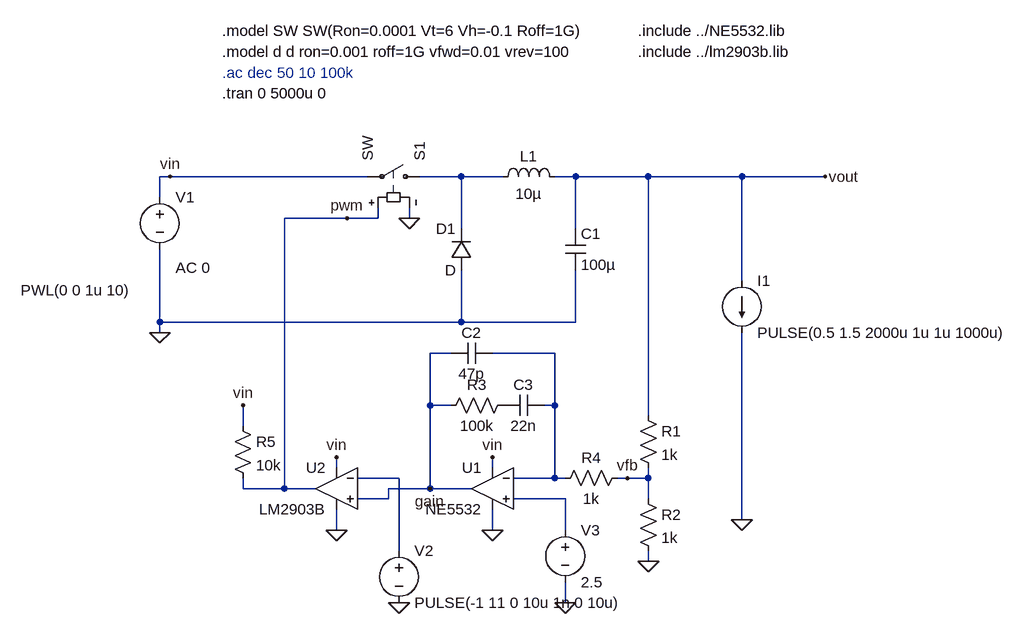
[diagram p0: schematic switching-fb.asc]
switching-fb.asc, the LTspice schematic file:
Version 4
SHEET 1 1492 788
WIRE -128 112 -144 112
WIRE 176 112 -128 112
WIRE 320 112 256 112
WIRE 384 112 320 112
WIRE 496 112 464 112
WIRE 608 112 496 112
WIRE 752 112 608 112
WIRE 880 112 752 112
WIRE -144 144 -144 112
WIRE 144 176 48 176
WIRE 192 176 192 160
WIRE 192 176 144 176
WIRE 240 176 240 160
WIRE 320 192 320 112
WIRE 496 192 496 112
WIRE 752 272 752 112
WIRE -144 336 -144 224
WIRE 320 336 320 256
WIRE 320 336 -144 336
WIRE 496 336 496 256
WIRE 496 336 320 336
WIRE -144 352 -144 336
WIRE 304 384 272 384
WIRE 464 384 368 384
WIRE 272 464 272 384
WIRE 304 464 272 464
WIRE 464 464 464 384
WIRE 464 464 448 464
WIRE 608 480 608 112
WIRE -16 496 -16 464
WIRE 128 560 128 544
WIRE 368 560 368 544
WIRE 224 576 160 576
WIRE 464 576 464 464
WIRE 464 576 400 576
WIRE 480 576 464 576
WIRE 576 576 560 576
WIRE 608 576 608 560
WIRE 608 576 576 576
WIRE -16 592 -16 576
WIRE 48 592 48 176
WIRE 48 592 -16 592
WIRE 96 592 48 592
WIRE 272 592 272 464
WIRE 272 592 208 592
WIRE 336 592 272 592
WIRE 208 608 208 592
WIRE 208 608 160 608
WIRE 480 608 400 608
WIRE 608 608 608 576
WIRE 752 640 752 352
WIRE 128 656 128 624
WIRE 368 656 368 624
WIRE 480 656 480 608
WIRE 224 688 224 576
WIRE 608 704 608 688
WIRE 480 768 480 736
FLAG -144 352 0
FLAG 880 112 vout
FLAG -128 112 vin
FLAG 144 176 pwm
FLAG 608 704 0
FLAG 480 768 0
FLAG 368 656 0
FLAG 752 640 0
FLAG 128 656 0
FLAG 240 176 0
FLAG 224 768 0
FLAG 576 576 vfb
FLAG 272 592 gain
FLAG 128 544 vin
FLAG 368 544 vin
FLAG -16 464 vin
SYMBOL voltage -144 128 R0
WINDOW 123 24 124 Left 2
WINDOW 39 0 0 Left 0
WINDOW 3 -214 159 Left 2
SYMATTR Value2 AC 0
SYMATTR Value PWL(0 0 1u 10)
SYMATTR InstName V1
SYMBOL ind 368 128 R270
WINDOW 0 32 56 VTop 2
WINDOW 3 5 56 VBottom 2
SYMATTR InstName L1
SYMATTR Value 10µ
SYMBOL cap 480 192 R0
SYMATTR InstName C1
SYMATTR Value 100µ
SYMBOL res 592 464 R0
SYMATTR InstName R1
SYMATTR Value 1k
SYMBOL res 592 592 R0
SYMATTR InstName R2
SYMATTR Value 1k
SYMBOL voltage 480 640 R0
WINDOW 123 0 0 Left 0
WINDOW 39 0 0 Left 0
SYMATTR InstName V3
SYMATTR Value 2.5
SYMBOL current 752 272 R0
WINDOW 123 0 0 Left 0
WINDOW 39 0 0 Left 0
SYMATTR InstName I1
SYMATTR Value PULSE(0.5 1.5 2000u 1u 1u 1000u)
SYMBOL diode 336 256 R180
WINDOW 0 24 64 Left 2
WINDOW 3 24 0 Left 2
SYMATTR InstName D1
SYMBOL sw 272 112 M270
SYMATTR InstName S1
SYMBOL voltage 224 672 R0
WINDOW 123 0 0 Left 0
WINDOW 39 0 0 Left 0
SYMATTR InstName V2
SYMATTR Value PULSE(-1 11 0 10u 1n 0 10u)
SYMBOL res 400 448 R90
WINDOW 0 0 56 VBottom 2
WINDOW 3 32 56 VTop 2
SYMATTR InstName R3
SYMATTR Value 100k
SYMBOL res 576 560 R90
WINDOW 0 0 56 VBottom 2
WINDOW 3 32 56 VTop 2
SYMATTR InstName R4
SYMATTR Value 1k
SYMBOL OpAmps\\opamp2 128 528 M0
SYMATTR InstName U2
SYMATTR Value LM2903B
SYMBOL OpAmps\\opamp2 368 528 M0
SYMATTR InstName U1
SYMATTR Value NE5532
SYMBOL res -32 480 R0
SYMATTR InstName R5
SYMATTR Value 10k
SYMBOL cap 368 368 R90
WINDOW 0 0 32 VBottom 2
WINDOW 3 32 32 VTop 2
SYMATTR InstName C2
SYMATTR Value 47p
SYMBOL cap 448 448 R90
WINDOW 0 0 32 VBottom 2
WINDOW 3 32 32 VTop 2
SYMATTR InstName C3
SYMATTR Value 22n
TEXT -48 -112 Left 2 !.model SW SW(Ron=0.0001 Vt=6 Vh=-0.1 Roff=1G)
TEXT -48 -80 Left 2 !.model d d ron=0.001 roff=1G vfwd=0.01 vrev=100
TEXT -48 -48 Left 2 ;.ac dec 50 10 100k
TEXT -48 -16 Left 2 !.tran 0 5000u 0
TEXT 592 -112 Left 2 !.include ../NE5532.lib
TEXT 592 -80 Left 2 !.include ../lm2903b.lib

The netlist it stands for:
* switching-fb.asc
V1 vin 0 PWL(0 0 1u 10) AC 0
L1 N001 vout 10µ
C1 vout 0 100µ
R1 vout vfb 1k
R2 vfb 0 1k
V3 N004 0 2.5
I1 vout 0 PULSE(0.5 1.5 2000u 1u 1u 1000u)
D1 0 N001 D
S1 N001 vin pwm 0 SW
V2 N003 0 PULSE(-1 11 0 10u 1n 0 10u)
R3 P001 gain 100k
R4 vfb N002 1k
XU2 gain N003 vin 0 pwm LM2903B  ; pins In+ In- V+ V- OUT
XU1 N004 N002 vin 0 gain NE5532  ; pins In+ In- V+ V- OUT
R5 vin pwm 10k
C2 N002 gain 47p
C3 N002 P001 22n
.model D D
.lib standard.dio
.model SW SW(Ron=0.0001 Vt=6 Vh=-0.1 Roff=1G)
.model d d ron=0.001 roff=1G vfwd=0.01 vrev=100
* .ac dec 50 10 100k
.tran 0 5000u 0
.include ../NE5532.lib
.include ../lm2903b.lib
.backanno
.end